# EAGLE schematic Conexão_Motor (EAGLE 6.2)
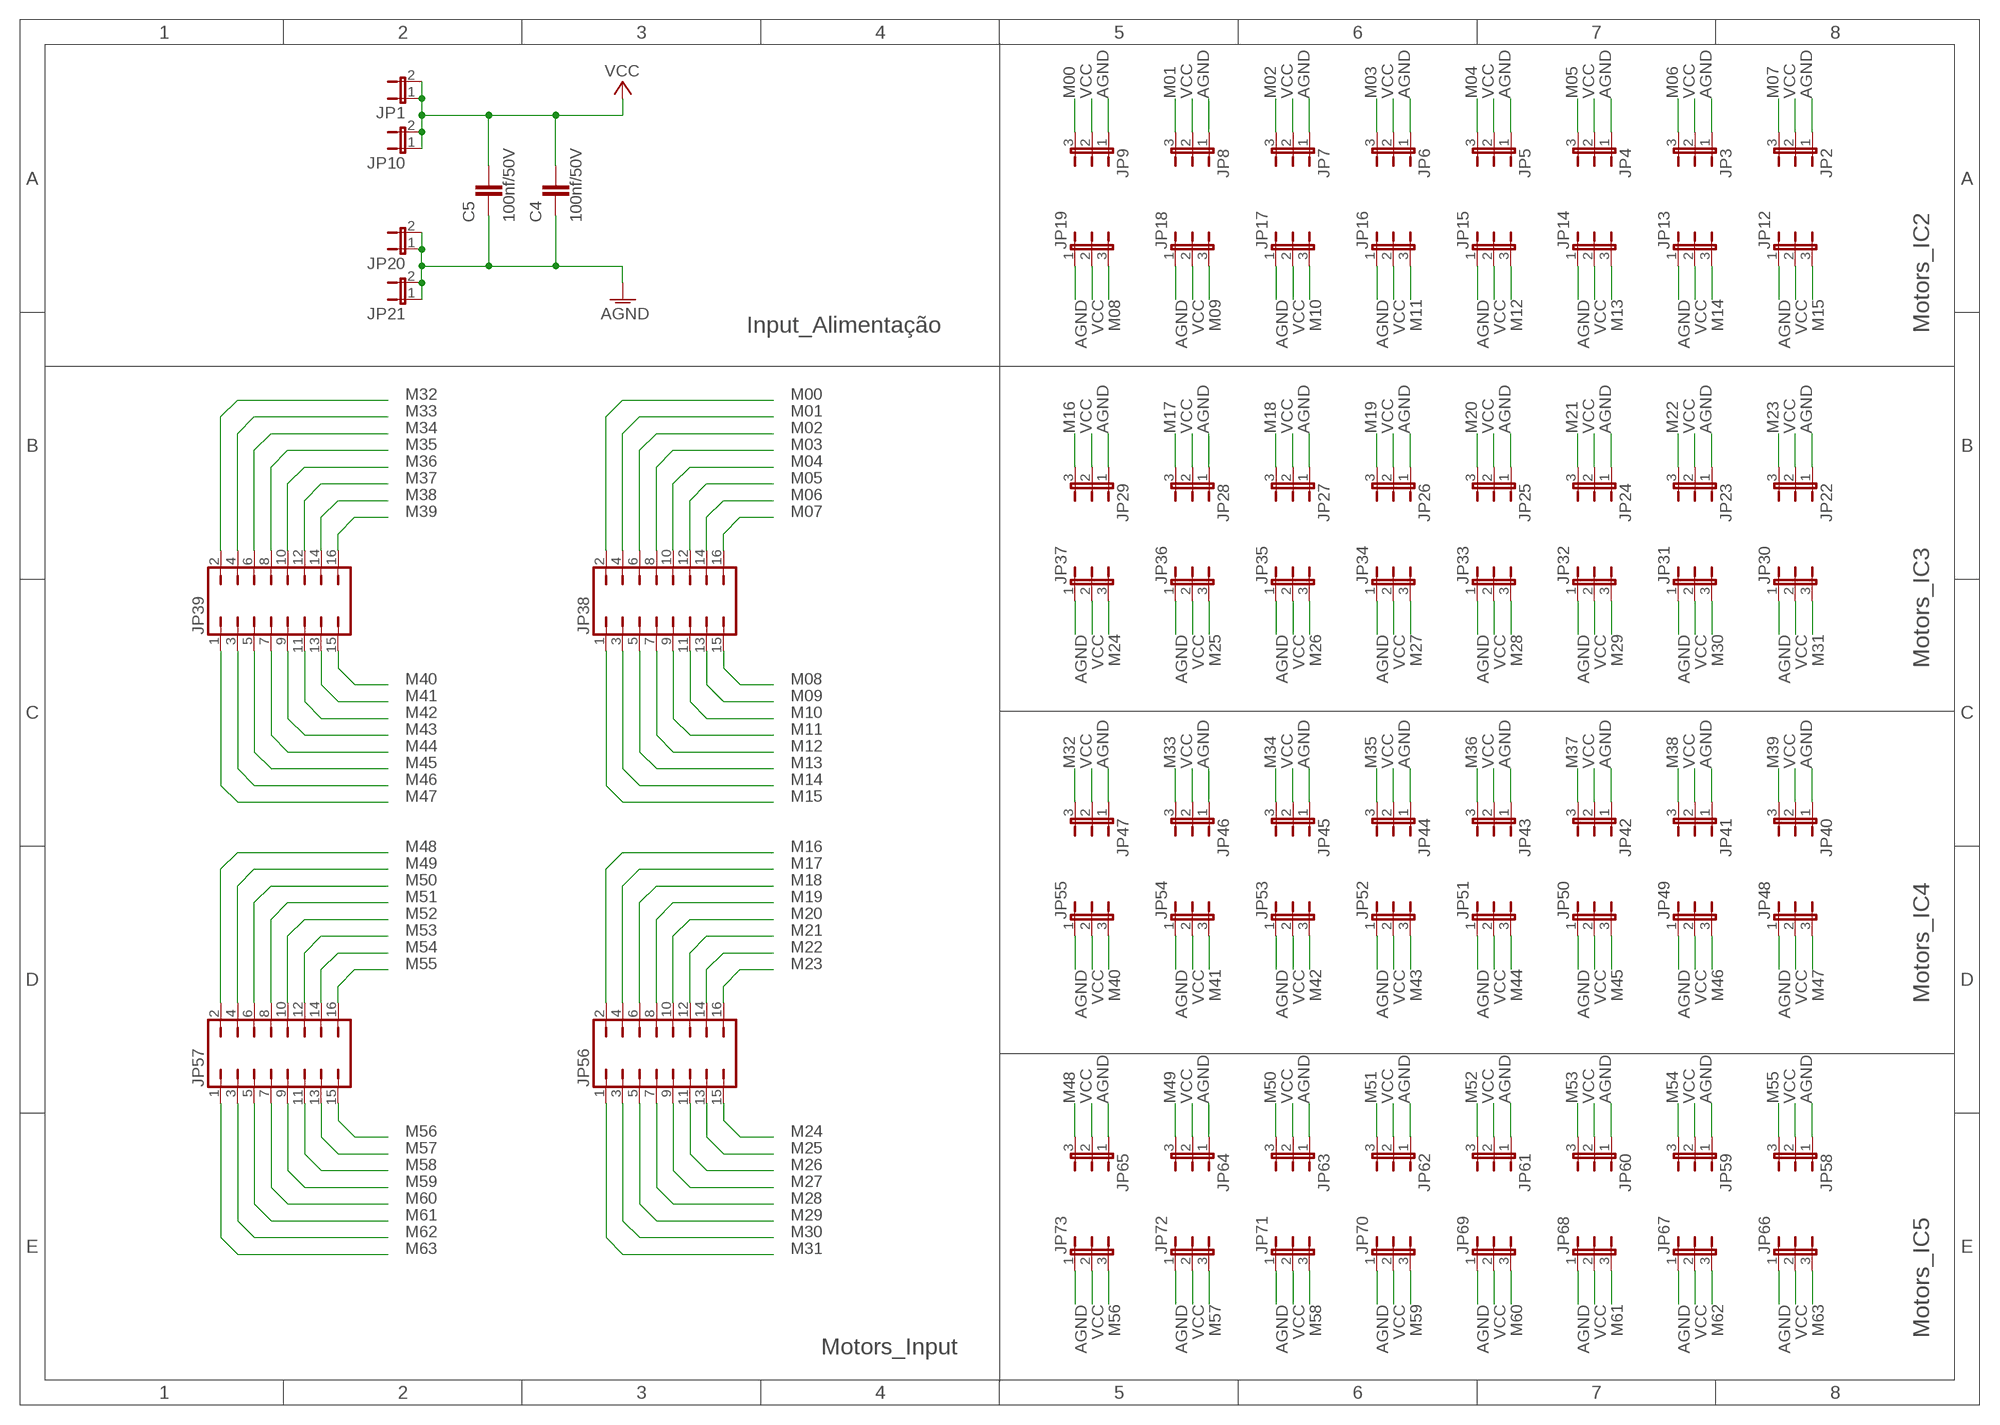
[diagram p0: schematic, sheet 1]

## Parts
C4  100nf/50V  C-EUC0805K  [C0805K]
C5  100nf/50V  C-EUC0805K  [C0805K]
JP1  JP1E  [JP1]
JP2  JP2E  [JP2]
JP3  JP2E  [JP2]
JP4  JP2E  [JP2]
JP5  JP2E  [JP2]
JP6  JP2E  [JP2]
JP7  JP2E  [JP2]
JP8  JP2E  [JP2]
JP9  JP2E  [JP2]
JP10  JP1E  [JP1]
JP12  JP2E  [JP2]
JP13  JP2E  [JP2]
JP14  JP2E  [JP2]
JP15  JP2E  [JP2]
JP16  JP2E  [JP2]
JP17  JP2E  [JP2]
JP18  JP2E  [JP2]
JP19  JP2E  [JP2]
JP20  JP1E  [JP1]
JP21  JP1E  [JP1]
JP22  JP2E  [JP2]
JP23  JP2E  [JP2]
JP24  JP2E  [JP2]
JP25  JP2E  [JP2]
JP26  JP2E  [JP2]
JP27  JP2E  [JP2]
JP28  JP2E  [JP2]
JP29  JP2E  [JP2]
JP30  JP2E  [JP2]
JP31  JP2E  [JP2]
JP32  JP2E  [JP2]
JP33  JP2E  [JP2]
JP34  JP2E  [JP2]
JP35  JP2E  [JP2]
JP36  JP2E  [JP2]
JP37  JP2E  [JP2]
JP38  JP8Q  [JP8Q]
JP39  JP8Q  [JP8Q]
JP40  JP2E  [JP2]
JP41  JP2E  [JP2]
JP42  JP2E  [JP2]
JP43  JP2E  [JP2]
JP44  JP2E  [JP2]
JP45  JP2E  [JP2]
JP46  JP2E  [JP2]
JP47  JP2E  [JP2]
JP48  JP2E  [JP2]
JP49  JP2E  [JP2]
JP50  JP2E  [JP2]
JP51  JP2E  [JP2]
JP52  JP2E  [JP2]
JP53  JP2E  [JP2]
JP54  JP2E  [JP2]
JP55  JP2E  [JP2]
JP56  JP8Q  [JP8Q]
JP57  JP8Q  [JP8Q]
JP58  JP2E  [JP2]
JP59  JP2E  [JP2]
JP60  JP2E  [JP2]
JP61  JP2E  [JP2]
JP62  JP2E  [JP2]
JP63  JP2E  [JP2]
JP64  JP2E  [JP2]
JP65  JP2E  [JP2]
JP66  JP2E  [JP2]
JP67  JP2E  [JP2]
JP68  JP2E  [JP2]
JP69  JP2E  [JP2]
JP70  JP2E  [JP2]
JP71  JP2E  [JP2]
JP72  JP2E  [JP2]
JP73  JP2E  [JP2]

## Nets
AGND: C4.2 C5.2 JP2.1 JP3.1 JP4.1 JP5.1 JP6.1 JP7.1 JP8.1 JP9.1 JP12.1 JP13.1 JP14.1 JP15.1 JP16.1 JP17.1 JP18.1 JP19.1 JP20.1 JP20.2 JP21.1 JP21.2 JP22.1 JP23.1 JP24.1 JP25.1 JP26.1 JP27.1 JP28.1 JP29.1 JP30.1 JP31.1 JP32.1 JP33.1 JP34.1 JP35.1 JP36.1 JP37.1 JP40.1 JP41.1 JP42.1 JP43.1 JP44.1 JP45.1 JP46.1 JP47.1 JP48.1 JP49.1 JP50.1 JP51.1 JP52.1 JP53.1 JP54.1 JP55.1 JP58.1 JP59.1 JP60.1 JP61.1 JP62.1 JP63.1 JP64.1 JP65.1 JP66.1 JP67.1 JP68.1 JP69.1 JP70.1 JP71.1 JP72.1 JP73.1
M00: JP9.3 JP38.2
M01: JP8.3 JP38.4
M02: JP7.3 JP38.6
M03: JP6.3 JP38.8
M04: JP5.3 JP38.10
M05: JP4.3 JP38.12
M06: JP3.3 JP38.14
M07: JP2.3 JP38.16
M08: JP19.3 JP38.15
M09: JP18.3 JP38.13
M10: JP17.3 JP38.11
M11: JP16.3 JP38.9
M12: JP15.3 JP38.7
M13: JP14.3 JP38.5
M14: JP13.3 JP38.3
M15: JP12.3 JP38.1
M16: JP29.3 JP56.2
M17: JP28.3 JP56.4
M18: JP27.3 JP56.6
M19: JP26.3 JP56.8
M20: JP25.3 JP56.10
M21: JP24.3 JP56.12
M22: JP23.3 JP56.14
M23: JP22.3 JP56.16
M24: JP37.3 JP56.15
M25: JP36.3 JP56.13
M26: JP35.3 JP56.11
M27: JP34.3 JP56.9
M28: JP33.3 JP56.7
M29: JP32.3 JP56.5
M30: JP31.3 JP56.3
M31: JP30.3 JP56.1
M32: JP39.2 JP47.3
M33: JP39.4 JP46.3
M34: JP39.6 JP45.3
M35: JP39.8 JP44.3
M36: JP39.10 JP43.3
M37: JP39.12 JP42.3
M38: JP39.14 JP41.3
M39: JP39.16 JP40.3
M40: JP39.15 JP55.3
M41: JP39.13 JP54.3
M42: JP39.11 JP53.3
M43: JP39.9 JP52.3
M44: JP39.7 JP51.3
M45: JP39.5 JP50.3
M46: JP39.3 JP49.3
M47: JP39.1 JP48.3
M48: JP57.2 JP65.3
M49: JP57.4 JP64.3
M50: JP57.6 JP63.3
M51: JP57.8 JP62.3
M52: JP57.10 JP61.3
M53: JP57.12 JP60.3
M54: JP57.14 JP59.3
M55: JP57.16 JP58.3
M56: JP57.15 JP73.3
M57: JP57.13 JP72.3
M58: JP57.11 JP71.3
M59: JP57.9 JP70.3
M60: JP57.7 JP69.3
M61: JP57.5 JP68.3
M62: JP57.3 JP67.3
M63: JP57.1 JP66.3
VCC: C4.1 C5.1 JP1.1 JP1.2 JP2.2 JP3.2 JP4.2 JP5.2 JP6.2 JP7.2 JP8.2 JP9.2 JP10.1 JP10.2 JP12.2 JP13.2 JP14.2 JP15.2 JP16.2 JP17.2 JP18.2 JP19.2 JP22.2 JP23.2 JP24.2 JP25.2 JP26.2 JP27.2 JP28.2 JP29.2 JP30.2 JP31.2 JP32.2 JP33.2 JP34.2 JP35.2 JP36.2 JP37.2 JP40.2 JP41.2 JP42.2 JP43.2 JP44.2 JP45.2 JP46.2 JP47.2 JP48.2 JP49.2 JP50.2 JP51.2 JP52.2 JP53.2 JP54.2 JP55.2 JP58.2 JP59.2 JP60.2 JP61.2 JP62.2 JP63.2 JP64.2 JP65.2 JP66.2 JP67.2 JP68.2 JP69.2 JP70.2 JP71.2 JP72.2 JP73.2

## Notes on the sheet
- Input_Alimentação
- Motors_IC2
- Motors_IC3
- Motors_IC4
- Motors_Input | Motors_IC5

## Library data of the parts
C4 C5 = rcl:C-EU: CAPACITOR, European symbol
JP1 JP10 JP20 JP21 = jumper:JP1E: JUMPER
JP2-JP9 JP12-JP19 JP22-JP37 JP40-JP55 JP58-JP73 = jumper:JP2E: JUMPER
JP38 JP39 JP56 JP57 = jumper:JP8Q: JUMPER